# EasyEDA Pro project 赛博樱花灯.epro, schematic Schematic1_1
Board Name: 上面板V0.2; Create Date: 2025-06-08; Page Name: P1; Project Name: 噬菌体拾音灯; Schematic Name: Schematic1_1; Update Date: 2025-06-08; Company: 嘉立创EDA; Page Size: A3; Version: V1.0
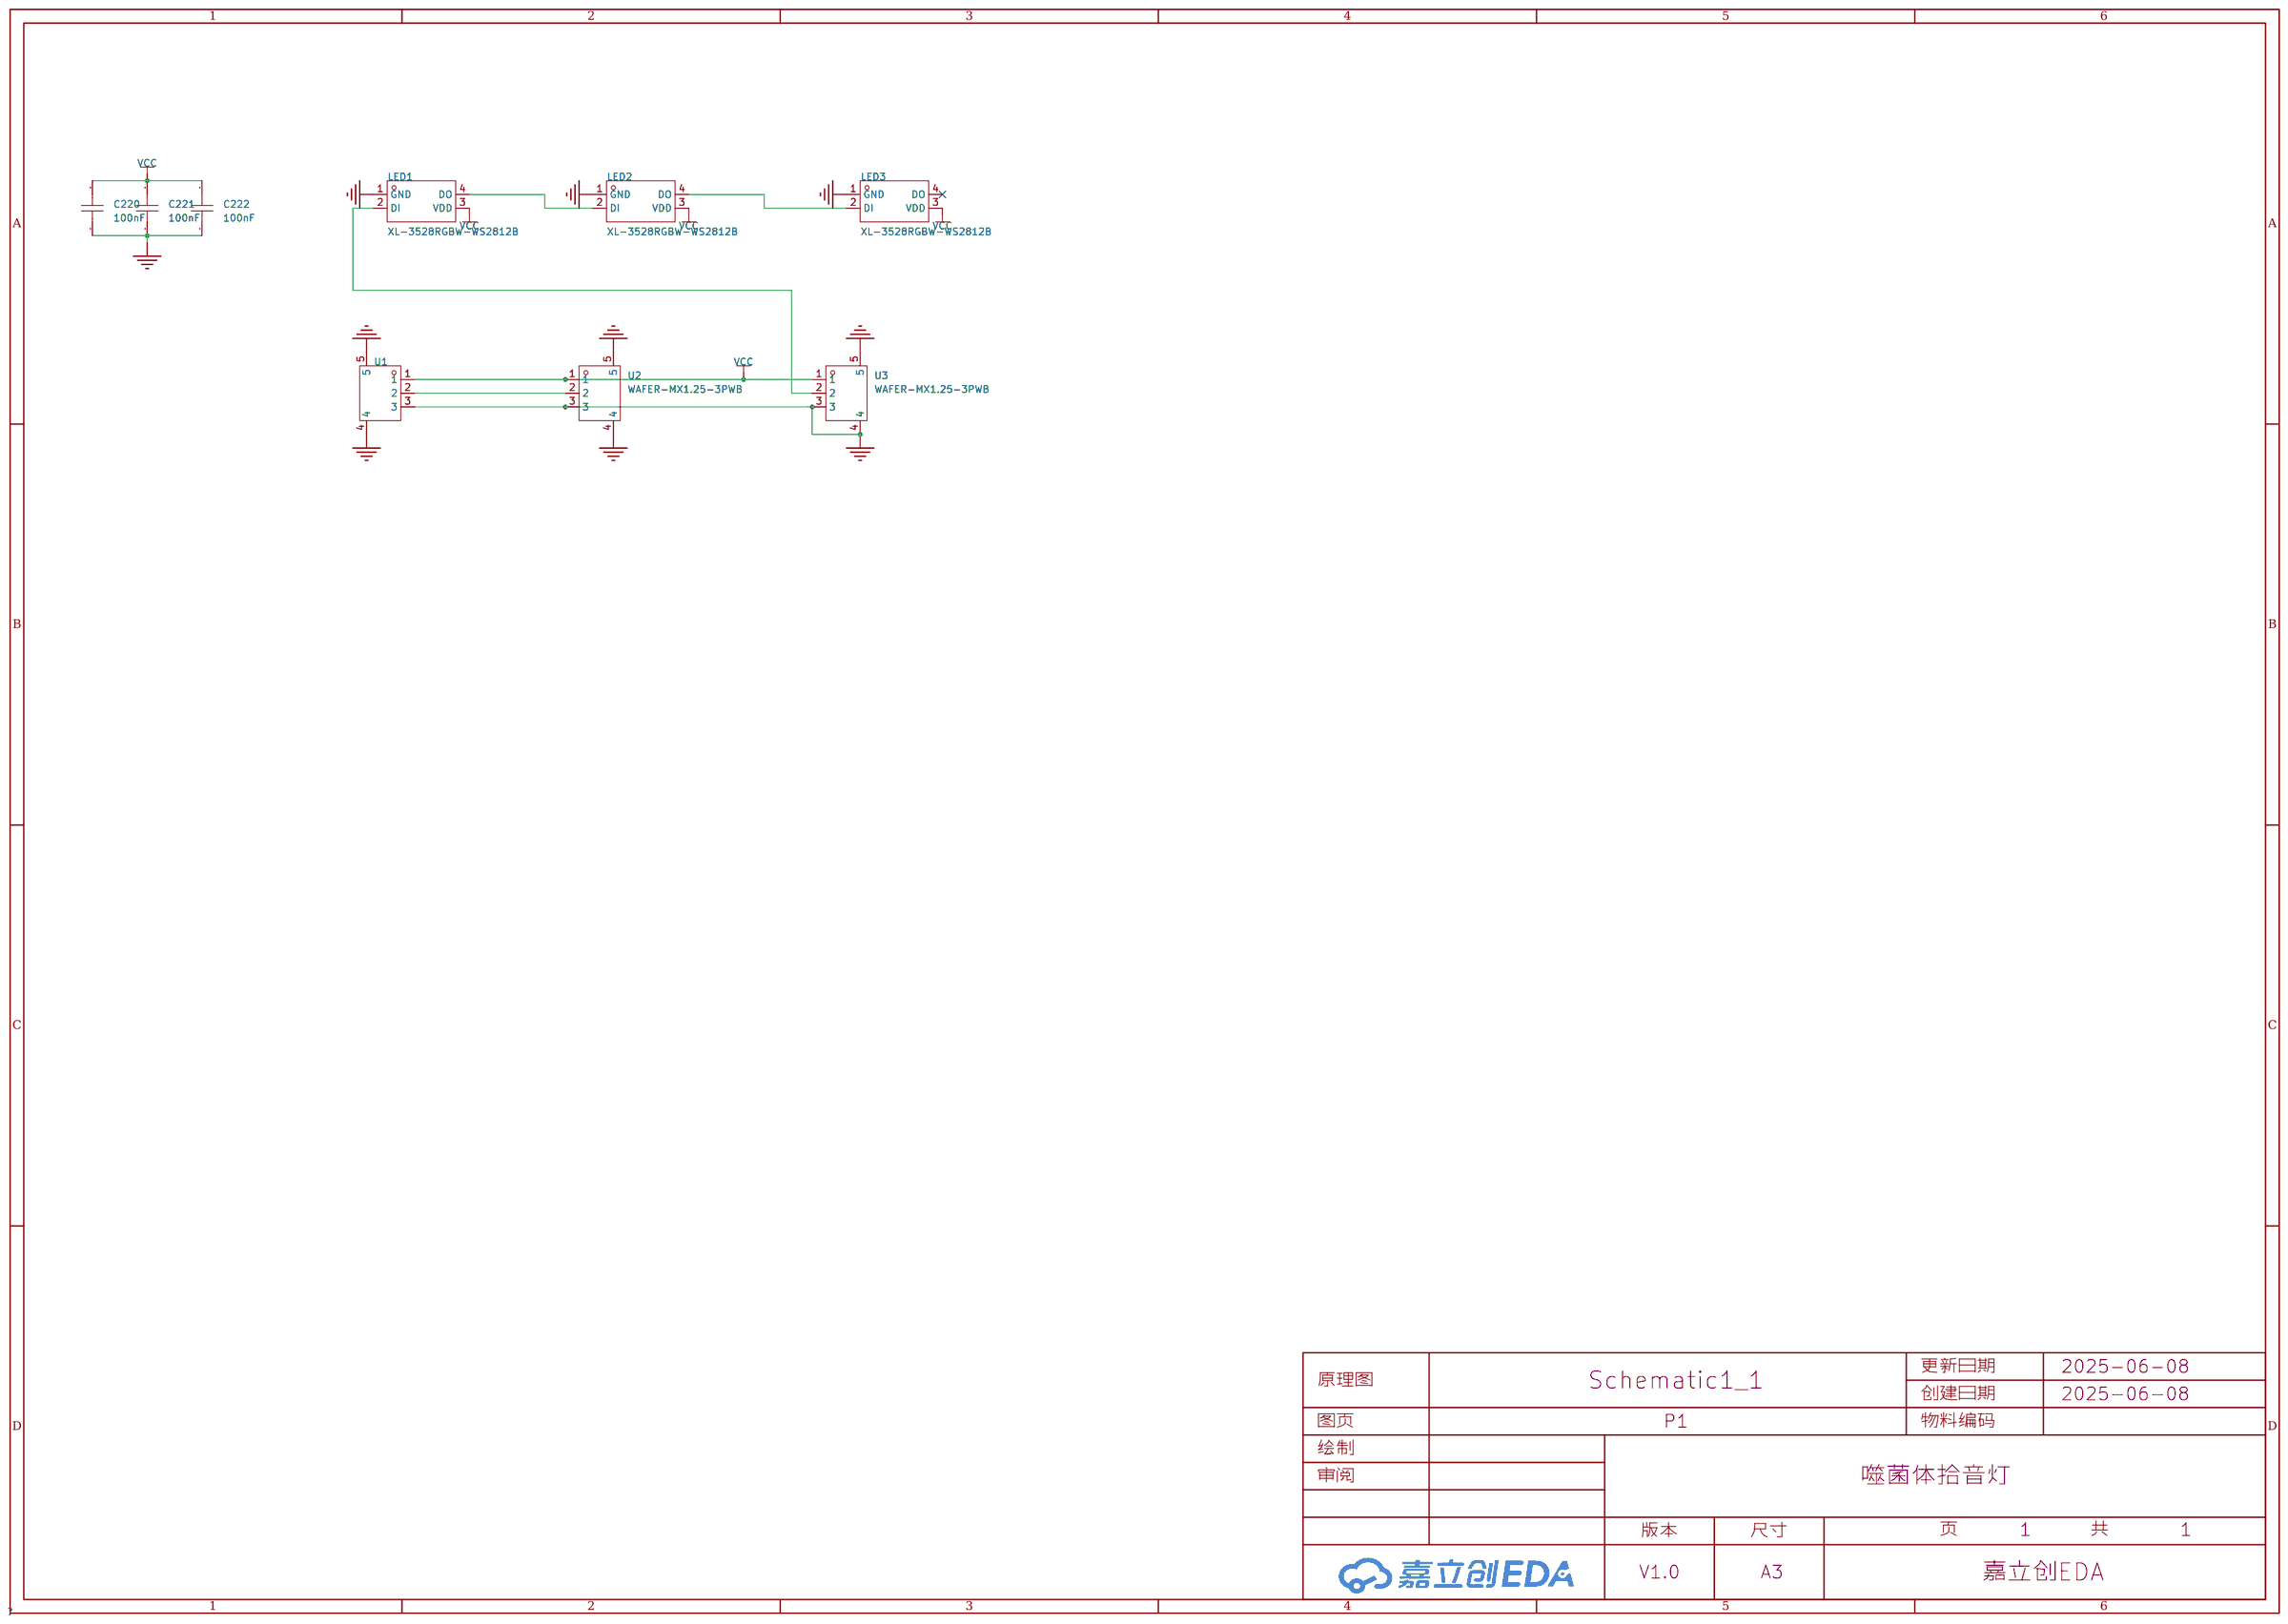
[diagram p5: schematic sheet]

## Parts
C220  100nF  [C0603]
C221  100nF  [C0603]
C222  100nF  [C0603]
LED1  XL-3528RGBW-WS2812B  [LED-SMD_4P-L3.5-W2.8-BR-1]
LED2  XL-3528RGBW-WS2812B  [LED-SMD_4P-L3.5-W2.8-BR-1]
LED3  XL-3528RGBW-WS2812B  [LED-SMD_4P-L3.5-W2.8-BR-1]
U1  WAFER-MX1.25-3PWB  [CONN-SMD_3P-P1.25_WAFER-MX1.25-3PWB]
U2  WAFER-MX1.25-3PWB  [CONN-SMD_3P-P1.25_WAFER-MX1.25-3PWB]
U3  WAFER-MX1.25-3PWB  [CONN-SMD_3P-P1.25_WAFER-MX1.25-3PWB]

## Library data of the parts
C220-C222 = CGA0603X7R104K500JT: 容值:100nF;精度:±10%;额定电压:50V;温度系数:X7R;; LCSC Part Name: 100nF ±10% 50V; Supplier Part: C6119867; Manufacturer: HRE(芯声); Supplier Footprint: 0603; JLCPCB Part Class: 扩展库; Datasheet: https://atta.szlcsc.com/upload/public/pdf/source/20250103/C44077DA9E7B3EFAE02F22B6D3D1CBC9.pdf; Supplier: LCSC; Tolerance: ±10%; Voltage Rating: 50V; Temperature Coefficient: X7R
LED1-LED3 = XL-3528RGBW-WS2812B: 3528 七彩幻彩雾状 ws2812B 内置驱动IC; Supplier Part: C2890364; Manufacturer: XINGLIGHT(成兴光); Supplier Footprint: SMD3528-4P; JLCPCB Part Class: 扩展库; Datasheet: https://atta.szlcsc.com/upload/public/pdf/source/20240218/041E1E0D0024617DFFF124D9C311BB4D.pdf; Supplier: LCSC
U1-U3 = WAFER-MX1.25-3PWB: 插针结构:1x3P;间距:1.25mm;安装方式:卧贴;参考系列:PicoBlade(MX 1.25);总PIN数:3P;排数:1;每排PIN数:3;行距:-;额定电流:1A;触头材质:黄铜;触头镀层:-;工作温度:-25℃~+85℃;; LCSC Part Name: 1x3P 间距:1.25mm 卧贴 系列:PicoBlade(MX 1.25); Supplier Part: C3029360; Manufacturer: XUNPU(讯普); Supplier Footprint: SMD,P=1.25mm,卧贴; JLCPCB Part Class: 扩展库; Datasheet: https://atta.szlcsc.com/upload/public/pdf/source/20220527/5ACBB683E384B6AD06743F272F933620.pdf; Supplier: LCSC; Pins Structure: 1x3P; Pitch: 1.25mm; Mounting Type: 卧贴; Reference Series: PicoBlade(MX 1.25); Number of Pins: 3P; Number of Rows: 1; Number of PINs Per Row: 3; Current Rating: 1A; Contact Material: 黄铜; Operating Temperature: -25℃~+85℃; Voltage Rating: 125V; Plastic Material: LCP; Supplementary Features: 辅助焊脚; Color: 米色; Z-Height of the Board: 3.6mm; X-Length of Bottom Edge on Board (Spacing Line): 8.75mm; Y-Width of Bottom Edge on Board: 5.25mm

## Nets
GND: C220.1 C221.1 C222.1 LED1.1(GND) LED2.1(GND) LED3.1(GND) U1.3 U1.4 U1.5 U2.3 U2.4 U2.5 U3.3 U3.4 U3.5
VCC: C220.2 C221.2 C222.2 LED1.3(VDD) LED2.3(VDD) LED3.3(VDD) U1.1 U2.1 U3.1
$1N828: LED1.4(DO) LED2.2(DI)
$1N837: LED2.4(DO) LED3.2(DI)
$1N1037: U1.2 U2.2
$1N1096: LED1.2(DI) U3.2

Not connected (* = marked no-connect by the designer): LED3 4(DO)*
